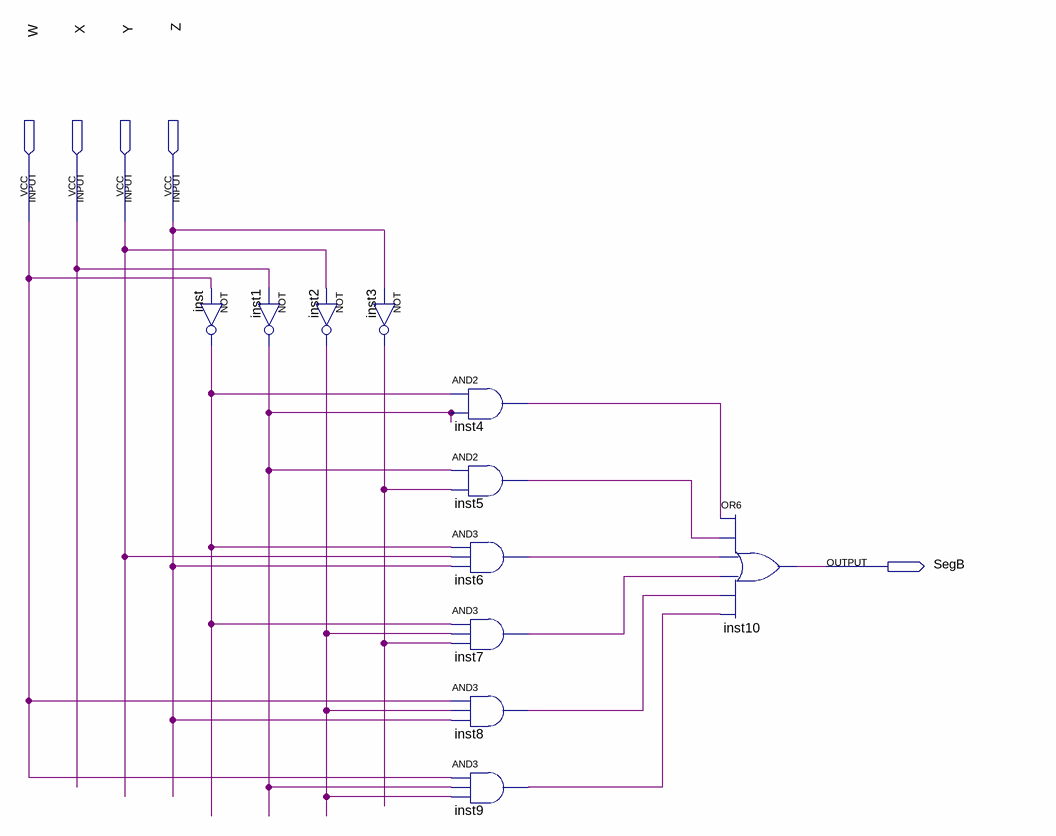
[diagram p0: schematic sheet]
// Quartus schematic SegB.bdf as structural Verilog: 11 symbols, 5 pins
module SegB (
  input  W,
  input  X,
  input  Y,
  input  Z,
  output SegB
);

  wire inst1_out, inst2_out, inst3_out, inst4_out, inst5_out, inst6_out, inst7_out, inst8_out, inst9_out,
       inst_out;

  not inst (inst_out, W);
  not inst1 (inst1_out, X);
  not inst2 (inst2_out, Y);
  not inst3 (inst3_out, Z);
  and inst4 (inst4_out, inst_out, inst1_out);
  and inst5 (inst5_out, inst1_out, inst3_out);
  and inst6 (inst6_out, inst_out, Y, Z);
  and inst7 (inst7_out, inst_out, inst2_out, inst3_out);
  and inst8 (inst8_out, W, inst2_out, Z);
  and inst9 (inst9_out, W, inst1_out, inst2_out);
  or inst10 (SegB, inst4_out, inst5_out, inst6_out, inst7_out, inst8_out, inst9_out);
endmodule
